# EAGLE design deathcap (EAGLE 8.2.1)
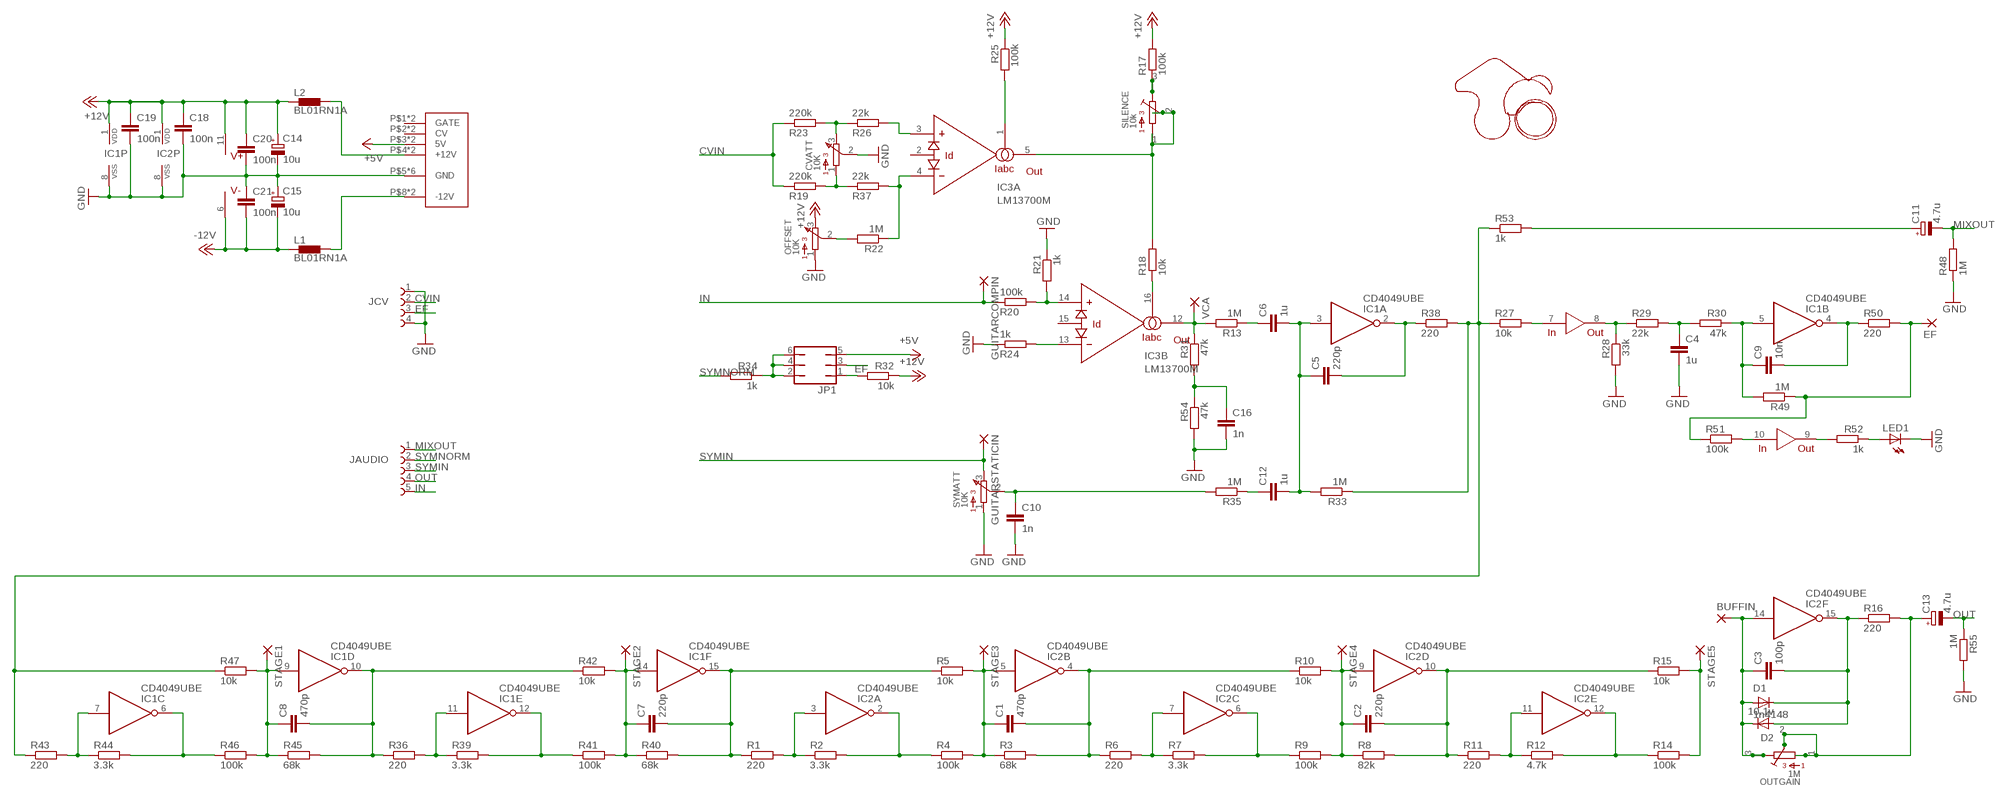
[diagram p0: schematic, sheet 1]

## Parts
BUFFIN  2,0/0,9-S  [2,0/0,9-S]
C1  470p  C-EUC1206  [C1206]
C2  220p  C-EUC1206  [C1206]
C3  100p  C-EUC1206  [C1206]
C4  1u  C-EUC1206  [C1206]
C5  220p  C-EUC1206  [C1206]
C6  1u  C-EUC1206  [C1206]
C7  220p  C-EUC1206  [C1206]
C8  470p  C-EUC1206  [C1206]
C9  10n  C-EUC1206  [C1206]
C10  1n  C-EUC1206  [C1206]
C11  4.7u  CPOL-EUD  [PANASONIC_D]
C12  1u  C-EUC1206  [C1206]
C13  4.7u  CPOL-EUD  [PANASONIC_D]
C14  10u  CPOL-EUD  [PANASONIC_D]
C15  10u  CPOL-EUD  [PANASONIC_D]
C16  1n  C-EUC1206  [C1206]
C18  100n  C-EUC1206  [C1206]
C19  100n  C-EUC1206  [C1206]
C20  100n  C-EUC1206  [C1206]
C21  100n  C-EUC1206  [C1206]
CVATT  10K  91  [91]
D1  1n4148  SOD123DIODE  [SOD-123_MINI-SMA]
D2  10.1v  SOD123DIODE  [SOD-123_MINI-SMA]
EF  2,0/0,9-S  [2,0/0,9-S]
GUITARCOMPIN  2,0/0,9-S  [2,0/0,9-S]
GUITARSTATICIN  2,0/0,9-S  [2,0/0,9-S]
IC1  CD4049UBE  [DIL16]
IC2  CD4049UBE  [DIL16]
IC3  LM13700M  [SO16]
JAUDIO  61300511121  [61300511121]
JCV  61300411121  [61300411121]
JP1  JP3Q  [JP3Q]
L1  BL01RN1A  [BL01RN1A]
L2  BL01RN1A  [BL01RN1A]
LED1  LED5MM  [LED5MM]
OFFSET  10K  91  [91]
OUTGAIN  1M  3386  [3386-MULTI]
R1  220  R-EU_R1206  [R1206]
R2  3.3k  R-EU_R1206  [R1206]
R3  68k  R-EU_R1206  [R1206]
R4  100k  R-EU_R1206  [R1206]
R5  10k  R-EU_R1206  [R1206]
R6  220  R-EU_R1206  [R1206]
R7  3.3k  R-EU_R1206  [R1206]
R8  82k  R-EU_R1206  [R1206]
R9  100k  R-EU_R1206  [R1206]
R10  10k  R-EU_R1206  [R1206]
R11  220  R-EU_R1206  [R1206]
R12  4.7k  R-EU_R1206  [R1206]
R13  1M  R-EU_R1206  [R1206]
R14  100k  R-EU_R1206  [R1206]
R15  10k  R-EU_R1206  [R1206]
R16  220  R-EU_R1206  [R1206]
R17  100k  R-EU_R1206  [R1206]
R18  10k  R-EU_R1206  [R1206]
R19  220k  R-EU_R1206  [R1206]
R20  100k  R-EU_R1206  [R1206]
R21  1k  R-EU_R1206  [R1206]
R22  1M  R-EU_R1206  [R1206]
R23  220k  R-EU_R1206  [R1206]
R24  1k  R-EU_R1206  [R1206]
R25  100k  R-EU_R1206  [R1206]
R26  22k  R-EU_R1206  [R1206]
R27  10k  R-EU_R1206  [R1206]
R28  33k  R-EU_R1206  [R1206]
R29  22k  R-EU_R1206  [R1206]
R30  47k  R-EU_R1206  [R1206]
R31  47k  R-EU_R1206  [R1206]
R32  10k  R-EU_R1206  [R1206]
R33  1M  R-EU_R1206  [R1206]
R34  1k  R-EU_R1206  [R1206]
R35  1M  R-EU_R1206  [R1206]
R36  220  R-EU_R1206  [R1206]
R37  22k  R-EU_R1206  [R1206]
R38  220  R-EU_R1206  [R1206]
R39  3.3k  R-EU_R1206  [R1206]
R40  68k  R-EU_R1206  [R1206]
R41  100k  R-EU_R1206  [R1206]
R42  10k  R-EU_R1206  [R1206]
R43  220  R-EU_R1206  [R1206]
R44  3.3k  R-EU_R1206  [R1206]
R45  68k  R-EU_R1206  [R1206]
R46  100k  R-EU_R1206  [R1206]
R47  10k  R-EU_R1206  [R1206]
R48  1M  R-EU_R1206  [R1206]
R49  1M  R-EU_R1206  [R1206]
R50  220  R-EU_R1206  [R1206]
R51  100k  R-EU_R1206  [R1206]
R52  1k  R-EU_R1206  [R1206]
R53  1k  R-EU_R1206  [R1206]
R54  47k  R-EU_R1206  [R1206]
R55  1M  R-EU_R1206  [R1206]
SILENCE  10k  3386  [3386-MULTI]
STAGE1  2,0/0,9-S  [2,0/0,9-S]
STAGE2  2,0/0,9-S  [2,0/0,9-S]
STAGE3  2,0/0,9-S  [2,0/0,9-S]
STAGE4  2,0/0,9-S  [2,0/0,9-S]
STAGE5  2,0/0,9-S  [2,0/0,9-S]
SYMATT  10K  91  [91]
U$1  EUROPWR  [EUROPWR]
U$2  LOGO  [LOGO]
VCA  2,0/0,9-S  [2,0/0,9-S]

## Nets
+5V: JP1.5 U$1.P$3(5V) U$1.P$14(5V)
+12V: C14.+ C18.1 C19.1 C20.1 IC1.1(P:VDD) IC2.1(P:VDD) IC3.11(V+) L2.1 OFFSET.3 R17.2 R25.1 R32.1
-12V: C15.- C21.2 IC3.6(V-) L1.1
CVIN: JCV.2 R19.1 R23.1
EF: JCV.3 JP1.3
GND: C4.2 C10.2 C14.- C15.+ C16.2 C18.2 C19.2 C20.2 C21.1 CVATT.2 IC1.8(P:VSS) IC2.8(P:VSS) JCV.1 JCV.4 LED1.K(C) OFFSET.1 R21.1 R24.1 R28.2 R48.1 R54.2 R55.2 SYMATT.1 U$1.P$5(GND) U$1.P$6(GND) U$1.P$7(GND) U$1.P$10(GND) U$1.P$11(GND) U$1.P$12(GND)
IN: GUITARCOMPIN.1(P) JAUDIO.5 R20.1
MIXOUT: C11.- JAUDIO.1 R48.2
N$1: IC3.16(B:IABC) R18.1
N$2: C1.1 IC2.5(B:I) R3.1 R4.2 R5.2 STAGE3.1(P)
N$3: C1.2 IC2.4(B:O) R3.2 R6.1 R10.1
N$4: IC2.3(A:I) R1.2 R2.1
N$5: IC2.2(A:O) R2.2 R4.1
N$6: C3.2 D1.C D2.A IC2.15(F:O) R16.1
N$7: C2.1 IC2.9(D:I) R8.1 R9.2 R10.2 STAGE4.1(P)
N$8: C2.2 IC2.10(D:O) R8.2 R11.1 R15.1
N$9: IC2.7(C:I) R6.2 R7.1
N$10: IC2.6(C:O) R7.2 R9.1
N$11: EF.1(P) R49.1 R50.2 R51.1
N$12: BUFFIN.1(P) C3.1 D1.A D2.C IC2.14(F:I) OUTGAIN.3 OUTGAIN.6
N$13: C9.2 IC1.4(B:O) R50.1
N$14: IC2.11(E:I) R11.2 R12.1
N$15: IC2.12(E:O) R12.2 R14.1
N$16: R1.1 R5.1
N$17: CVATT.1 R19.2 R37.1
N$18: IC3.13(B:-IN) R24.2
N$19: CVATT.3 R23.2 R26.1
N$20: IC3.14(B:+IN) R20.2 R21.2
N$21: IC3.5(A:OUT) R18.2 SILENCE.1 SILENCE.2 SILENCE.4 SILENCE.5
N$22: C6.1 R13.1
N$23: IC3.3(A:+IN) R26.2
N$24: C12.1 R35.1
N$25: OFFSET.2 R22.2
N$26: IC3.1(A:IABC) R25.2
N$27: IC3.7(IN) R27.2
N$28: IC3.8(OUT) R28.1 R29.1
N$29: C4.1 R29.2 R30.2
N$30: R17.1 SILENCE.3 SILENCE.6
N$31: C5.1 C6.2 C12.2 IC1.3(A:I) R33.2
N$32: C5.2 IC1.2(A:O) R38.1
N$33: IC3.10(IN) R51.2
N$34: IC3.9(OUT) R52.2
N$35: JP1.2 JP1.4 JP1.6 R34.1
N$36: IC3.12(B:OUT) R13.2 R31.1 VCA.1(P)
N$37: JP1.1 R32.2
N$38: IC3.4(A:-IN) R22.1 R37.2
N$39: C10.1 R35.2 SYMATT.2
N$40: R27.1 R33.1 R38.2 R43.1 R47.1 R53.1
N$41: C7.1 IC1.14(F:I) R40.1 R41.2 R42.2 STAGE2.1(P)
N$42: C7.2 IC1.15(F:O) R40.2
N$43: IC1.11(E:I) R36.2 R39.1
N$44: IC1.12(E:O) R39.2 R41.1
N$45: R36.1 R42.1
N$46: C8.1 IC1.9(D:I) R45.1 R46.2 R47.2 STAGE1.1(P)
N$47: C8.2 IC1.10(D:O) R45.2
N$48: IC1.7(C:I) R43.2 R44.1
N$49: IC1.6(C:O) R44.2 R46.1
N$50: C9.1 IC1.5(B:I) R30.1 R49.2
N$51: LED1.A R52.1
N$52: C11.+ R53.2
N$53: L2.2 U$1.P$4(+12V) U$1.P$13(+12V)
N$54: L1.2 U$1.P$8(-12V) U$1.P$9(-12V)
N$55: C16.1 R31.2 R54.1
N$56: C13.+ OUTGAIN.1 OUTGAIN.2 OUTGAIN.4 OUTGAIN.5 R16.2
N$57: R14.2 R15.2 STAGE5.1(P)
OUT: C13.- JAUDIO.4 R55.1
SYMIN: GUITARSTATICIN.1(P) JAUDIO.3 SYMATT.3
SYMNORM: JAUDIO.2 R34.2
Unconnected: IC3.2(A:ID) IC3.15(B:ID) U$1.P$1(GATE) U$1.P$2(CV) U$1.P$15(CV) U$1.P$16(GATE)

## Library data of the parts
BUFFIN EF GUITARCOMPIN GUITARSTATICIN STAGE1-STAGE5 VCA = synthdiy updated imperial:2,0/0,9-S: SQUARE THROUGH-HOLE PAD 2.0 mm, 0.9 mm/0.079",0.035"
C1-C10 C12 C16 C18-C21 = resistor:C-EU: CAPACITOR, European symbol
C11 C13-C15 = resistor:CPOL-EU: POLARIZED CAPACITOR, European symbol
CVATT OFFSET SYMATT = bourns:91: 91 Series Potentiometer
D1 D2 = stuaiff:SOD123DIODE: generalised sod 123 diode
IC1 IC2 = integrated circuits:CD4049UBE: Hex Inverting Buffer Used, for example, in the Red Llama, Three Legged Dog, and Hot Harmonics.
IC3 = synthdiy updated imperial:LM13700: National Dual OTA with buffers.
JAUDIO = Board-to-Board (rev17e):61300511121: WR-PHD 2.54mm Pin Header, 5 Pin =>Code : Con_BTB_PHD_2.54_1_THT_61300511121 <http://katalog.we-online.de/media/images/eican/Con_BTB_PHD_2.54_1_THT_6130xx11121_pf2.jpg> Details see: http://katalog.we-online.de/en/em/613_0xx_111_21 Created 2014-05-29, Karrer Zheng 2014 (C) Würth Elektronik
JCV = Board-to-Board (rev17e):61300411121: WR-PHD 2.54mm Pin Header, 4 Pin =>Code : Con_BTB_PHD_2.54_1_THT_61300411121 <http://katalog.we-online.de/media/images/eican/Con_BTB_PHD_2.54_1_THT_6130xx11121_pf2.jpg> Details see: http://katalog.we-online.de/en/em/613_0xx_111_21 Created 2014-05-29, Karrer Zheng 2014 (C) Würth Elektronik
JP1 = jumper:JP3Q: JUMPER
L1 L2 = inductors:BL0: Noise Suppression Products/EMI Suppression Filters, Lead EMIFIL(R) Inductor Type Source: http://www.murata.com .. BL01RN1_DS.pdf
LED1 = led:LED: LED OSRAM: - CHIPLED LG R971, LG N971, LY N971, LG Q971, LY Q971, LO R971, LY R971 LH N974, LH R974 LS Q976, LO Q976, LY Q976 LO Q996 - Hyper CHIPLED LW Q18S LB Q993, LB Q99A, LB R99A - SideLED LS A670, LO A670, LY A670, LG A670, LP A670 LB A673, LV A673, LT A673, LW A673 LH A674 LY A675 LS A676, LA A676, LO A676, LY A676, LW A676 LS A679, LY A679, LG A679 - Hyper Micro SIDELED® LS Y876, LA Y876, LO Y876, LY Y876 LT Y87S - SmartLED LW L88C, LW L88S LB L89C, LB L89S, LG L890 LS L89K, LO L89K, LY L89K LS L896, LA L896, LO L896, LY L896 - TOPLED LS T670, LO T670, LY T670, LG T670, LP T670 LSG T670, LSP T670, LSY T670, LOP T670, LYG T670 LG T671, LOG T671, LSG T671 LB T673, LV T673, LT T673, LW T673 LH T674 LS T676, LA T676, LO T676, LY T676, LB T676, LH T676, LSB T676, LW T676 LB T67C, LV T67C, LT T67C, LS T67K, LO T67K, LY T67K, LW E67C LS E67B, LA E67B, LO E67B, LY E67B, LB E67C, LV E67C, LT E67C LW T67C LS T679, LY T679, LG T679 LS T770, LO T770, LY T770, LG T770, LP T770 LB T773, LV T773, LT T773, LW T773 LH T774 LS E675, LA E675, LY E675, LS T675 LS T776, LA T776, LO T776, LY T776, LB T776 LHGB T686 LT T68C, LB T68C - Hyper Mini TOPLED® LB M676 - Mini TOPLED Santana® LG M470 LS M47K, LO M47K, LY M47K Source: http://www.osram.convergy.de LUXEON: - LUMILED® LXK2-PW12-R00, LXK2-PW12-S00, LXK2-PW14-U00, LXK2-PW14-V00 LXK2-PM12-R00, LXK2-PM12-S00, LXK2-PM14-U00 LXK2-PE12-Q00, LXK2-PE12-R00, LXK2-PE12-S00, LXK2-PE14-T00, LXK2-PE14-U00 LXK2-PB12-K00, LXK2-PB12-L00, LXK2-PB12-M00, LXK2-PB14-N00, LXK2-PB14-P00, LXK2-PB14-Q00 LXK2-PR12-L00, LXK2-PR12-M00, LXK2-PR14-Q00, LXK2-PR14-R00 LXK2-PD12-Q00, LXK2-PD12-R00, LXK2-PD12-S00 LXK2-PH12-R00, LXK2-PH12-S00 LXK2-PL12-P00, LXK2-PL12-Q00, LXK2-PL12-R00 Source: www.luxeon.com KINGBRIGHT: KA-3528ASYC Source: www.kingbright.com
OUTGAIN SILENCE = bourns:3386: 3386 Series 3/8" Square Trimmer (Multi-Package F,P,K & Y)
R1-R55 = resistor:R-EU_: RESISTOR, European symbol
U$1 = stuaiff:EUROPWR: standard 16 pin eurorack power connector
U$2 = stuaiff:LOGO

## Board
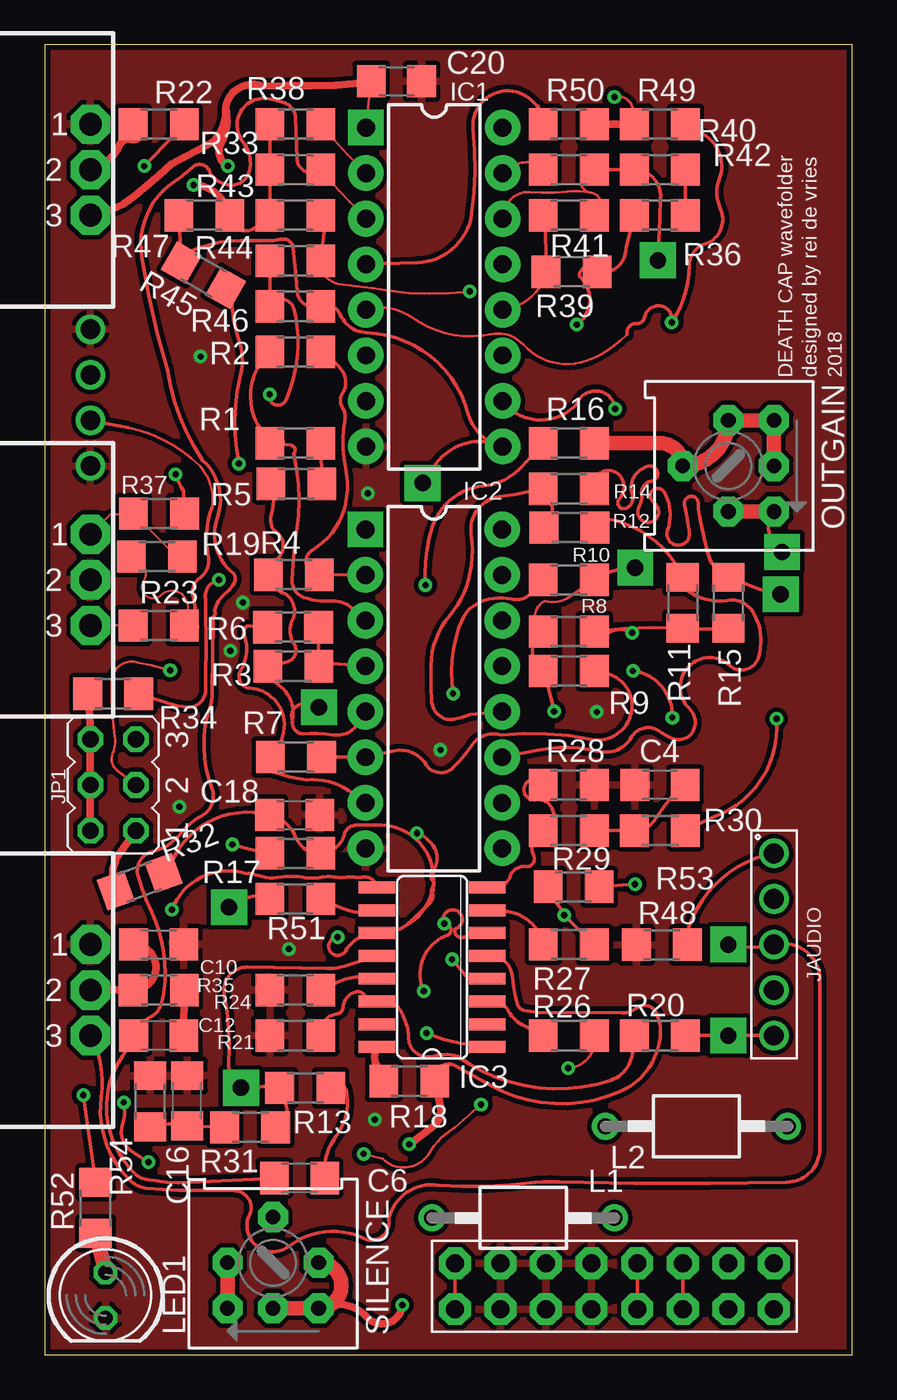
[diagram p1: board, top side]
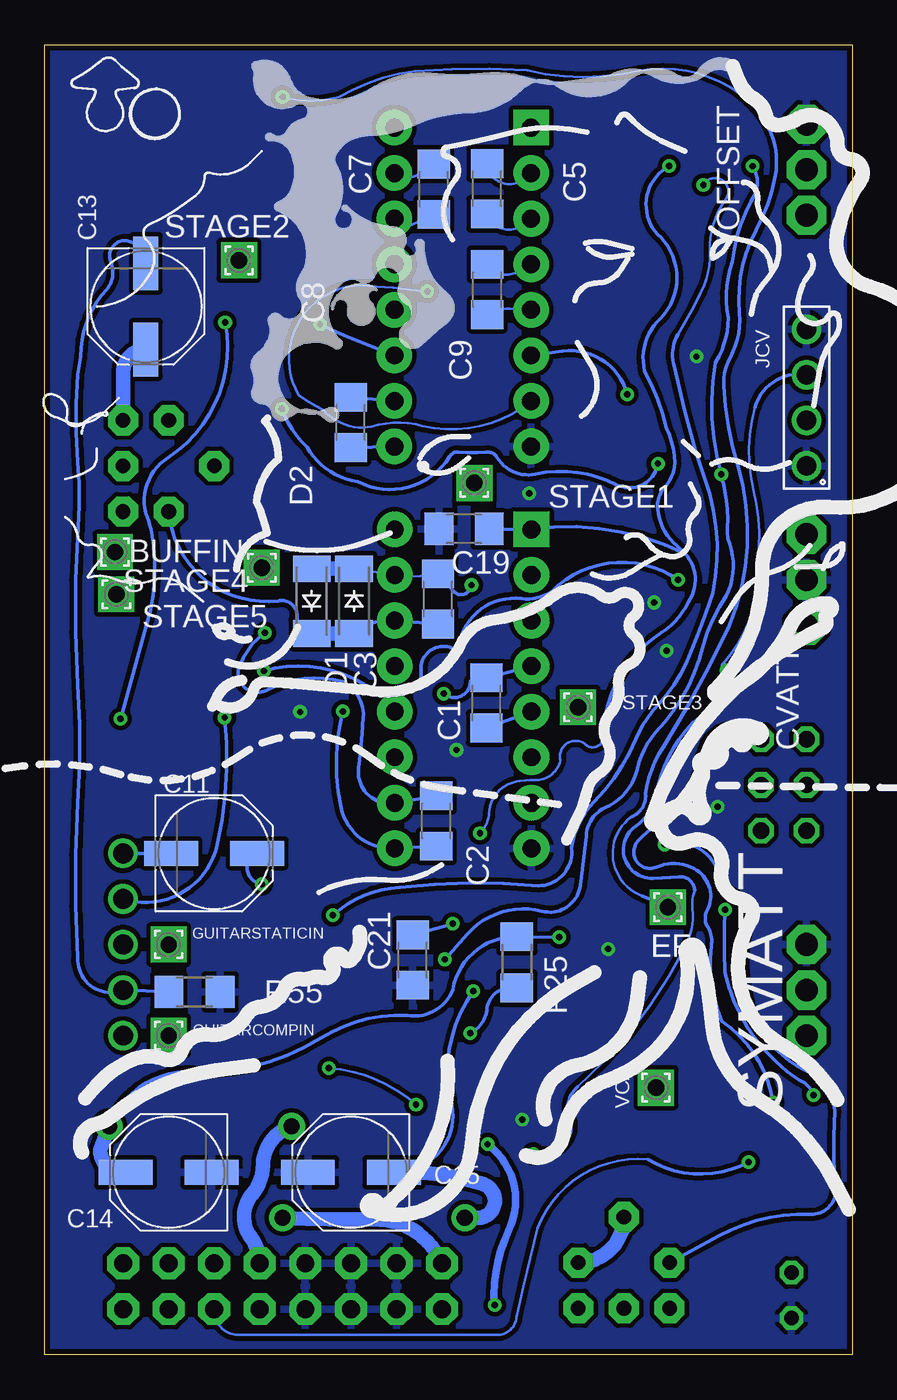
[diagram p2: board, bottom side, seen from below]

Size 45 x 73 mm. Coordinates in mm from the lower left corner, seen from the top.
Outline: 0,0 45,0 45,73 0,73 0,0
Copper layers (1*16): Top 0.035mm / dielectric 1.5mm / Bottom 0.035mm
Design rules "seeedincomplete": minimum track width 4mil, minimum drill 0.35mm, track to track 4mil, track to pad 4mil, pad to pad 4mil, via to via 12mil, smd to smd 4mil, copper to edge 0.3mm, drill to drill 6mil, minimum pad ring 10mil, minimum via ring 8mil, stop-mask expansion 4mil, vias tented up to drill 0mil, thermal gap 10mil

### Footprints (pad centres in the part's own frame; a part is rotated, then mirrored left to right if it is on the bottom)
2,0/0,9-S = drill 0.914 pad 2 square: 1 0,0
C1206 = smd 1.6 x 1.8: 1 -1.4,0; 2 1.4,0
PANASONIC_D = smd 3 x 1.4: + 2.4,0; - -2.4,0
91 = drill 1.27 pad 2.184 octagon: 1 0,2.54; 2 0,0; 3 0,-2.54
SOD-123_MINI-SMA = smd 1.5 x 2.1: A 1.8,0; C -1.8,0
DIL16 = drill 1 pad 1.981 square: 1 -8.89,-3.81 | drill 1 pad 1.981: 2 -6.35,-3.81; 3 -3.81,-3.81; 4 -1.27,-3.81; 5 1.27,-3.81; 6 3.81,-3.81; 7 6.35,-3.81; 8 8.89,-3.81; 9 8.89,3.81; 10 6.35,3.81; 11 3.81,3.81; 12 1.27,3.81; 13 -1.27,3.81; 14 -3.81,3.81; 15 -6.35,3.81; 16 -8.89,3.81
SO16 = smd 0.66 x 2.032: 1 -4.445,-3.073; 2 -3.175,-3.073; 3 -1.905,-3.073; 4 -0.635,-3.073; 5 0.635,-3.073; 6 1.905,-3.073; 7 3.175,-3.073; 8 4.445,-3.073; 9 4.445,3.073; 10 3.175,3.073; 11 1.905,3.073; 12 0.635,3.073; 13 -0.635,3.073; 14 -1.905,3.073; 15 -3.175,3.073; 16 -4.445,3.073
61300511121 = drill 1.1: 1 -5.08,0; 2 -2.54,0; 3 0,0; 4 2.54,0; 5 5.08,0
61300411121 = drill 1.1: 1 -3.81,0; 2 -1.27,0; 3 1.27,0; 4 3.81,0
JP3Q = drill 0.914 octagon: 1 -2.54,-1.27; 2 -2.54,1.27; 3 0,-1.27; 4 0,1.27; 5 2.54,-1.27; 6 2.54,1.27
BL01RN1A = drill 0.9 pad 1.5: 1 -5.08,0; 2 5.08,0
LED5MM = drill 0.813 octagon: A -1.27,0; K 1.27,0
3386-MULTI = drill 0.813 pad 1.676 octagon: 1 -2.54,0; 2 0,-2.54; 3 2.54,0; 4 -2.54,2.54; 5 0,2.54; 6 2.54,2.54
R1206 = smd 1.6 x 1.803: 1 -1.422,0; 2 1.422,0
EUROPWR = drill 1 pad 1.778 octagon: P$1 -1.27,8.89; P$2 -1.27,6.35; P$3 -1.27,3.81; P$4 -1.27,1.27; P$5 -1.27,-1.27; P$6 -1.27,-3.81; P$7 -1.27,-6.35; P$8 -1.27,-8.89; P$9 1.27,-8.89; P$10 1.27,-6.35; P$11 1.27,-3.81; P$12 1.27,-1.27; P$13 1.27,1.27; P$14 1.27,3.81; P$15 1.27,6.35; P$16 1.27,8.89

### Placement (x,y rotation side)
BUFFIN  41.09,44.73 0 bottom
C1  20.38,36.32 90 bottom
C2  23.18,29.74 90 bottom
C3  23.09,42.12 90 bottom
C4  34.29,31.75 180 top
C5  20.35,64.98 90 bottom
C6  14.2,9.84 180 top
C7  23.31,64.95 90 bottom
C8  27.95,51.96 90 bottom
C9  20.34,59.36 90 bottom
C10  6.35,22.86 0 top
C11  35.56,27.94 0 bottom
C12  6.35,17.78 180 top
C13  39.37,58.42 270 bottom
C14  38.1,10.16 180 bottom
C15  27.94,10.16 180 bottom
C16  7.93,14.16 90 top
C18  13.93,30.08 0 top
C19  21.63,46.02 180 bottom
C20  19.6,70.97 0 top
C21  24.5,21.99 90 bottom
CVATT  2.54,43.18 0 top
D1  27.77,42 270 bottom
D2  30.12,42 90 bottom
EF  10.27,24.94 0 bottom
GUITARCOMPIN  38.1,17.78 0 bottom
GUITARSTATICIN  38.1,22.86 0 bottom
IC1  21.71,59.5 270 top
IC2  21.68,37.11 270 top
IC3  21.59,21.59 90 top
JAUDIO  40.64,22.86 270 top
JCV  2.54,53.34 90 bottom
JP1  3.81,31.75 90 top
L1  26.67,7.62 0 top
L2  36.32,12.73 180 top
LED1  3.38,3.31 270 top
OFFSET  2.54,66.04 0 top
OUTGAIN  38.1,49.53 270 top
R1  13.97,50.8 180 top
R2  13.97,55.88 0 top
R3  13.85,38.36 0 top
R4  13.88,43.47 180 top
R5  14.02,48.53 180 top
R6  13.83,40.55 180 top
R7  14,33.31 0 top
R8  29.21,40.3 0 top
R9  29.21,38.1 180 top
R10  29.21,43.18 0 top
R11  35.56,41.91 90 top
R12  29.25,46.1 180 top
R13  14.51,14.87 180 top
R14  29.21,48.26 0 top
R15  38.1,41.91 90 top
R16  29.21,50.8 0 top
R17  13.97,27.94 0 top
R18  20.32,15.24 0 top
R19  6.25,44.48 0 top
R20  34.29,17.78 180 top
R21  13.97,17.78 0 top
R22  6.35,68.58 180 top
R23  6.35,40.64 180 top
R24  13.97,20.32 0 top
R25  18.69,21.87 270 bottom
R26  29.21,17.78 180 top
R27  29.21,22.86 180 top
R28  29.21,31.75 0 top
R29  29.21,29.21 0 top
R30  34.29,29.21 180 top
R31  11.44,12.67 180 top
R32  5.28,26.36 200 top
R33  13.97,66.04 0 top
R34  3.81,36.83 0 top
R35  6.35,20.32 180 top
R36  34.29,63.5 180 top
R37  6.37,46.88 0 top
R38  13.97,68.58 180 top
R39  29.36,60.35 180 top
R40  29.21,66.04 180 top
R41  29.21,63.5 0 top
R42  34.29,66.04 180 top
R43  13.97,63.5 0 top
R44  13.97,60.96 180 top
R45  8.84,60.15 330 top
R46  13.97,58.42 0 top
R47  8.89,63.5 180 top
R48  34.39,22.84 0 top
R49  34.29,68.58 0 top
R50  29.21,68.58 0 top
R51  13.97,25.4 0 top
R52  2.82,8.18 90 top
R53  29.48,26.08 0 top
R54  5.87,14.12 90 top
R55  36.66,20.22 0 bottom
SILENCE  12.72,5.13 180 top
STAGE1  21.06,48.59 0 bottom
STAGE2  34.17,60.99 0 bottom
STAGE3  15.28,36.08 0 bottom
STAGE4  32.91,43.86 0 bottom
STAGE5  41.02,42.38 0 bottom
SYMATT  2.54,20.32 0 top
U$1  31.75,3.81 270 top
U$2  40.34,69.27 0 bottom
VCA  10.93,14.87 0 bottom

### Tracks (layer width: path | path; a pad name or v marks a point on that pad's centre or on a via)
+5V  (via drill 0.35)
  Top 0.203: v5.77,10.73 4.81,11.36 arc-74 4.32,12.76 arc28 v4.4,14.06 | U$1.P$3 U$1.P$14
  Bottom 0.152: U$1.P$14 35.56,2.44 arc-90 34.22,1.1 19.79,1.1 arc-90 18.7,2.2 arc2 17.53,7.03 arc75 11.38,10.88 | JP1.5 arc-137 8.38,33.4
  Bottom 0.203: 11.38,10.88 arc-59 v5.77,10.73 | v4.4,14.06 arc-47 7.25,18.57 arc29 7.85,22.78 arc-43 8.05,23.83 arc60 8.08,24.74 arc-85 8.65,26.98 arc-57 10.89,27.17 arc156 11.93,28.63 arc16 10.83,29.54 arc-52 8.38,33.4
+12V  (via drill 0.35)
  Top 0.152: IC1.1 18.16,70.86
  Top 0.203: v16.32,23.26 arc239 16.77,22.5 arc-61 IC3.11 arc30 20.11,23.89 | 20.11,23.89 arc150 18.75,29.51 arc3 17.33,29.51 arc74 16.7,29 arc-73 R17.2 arc-71 13.96,28.88 arc58 C18.1 arc83 7.04,27.38 arc-27 6.82,26.73 arc-97 6.05,26.68 R32.1 | v20.74,29.07 arc-41 21.72,28.25 arc-69 21.59,26.92 arc88 21.63,26.42 arc-95 21.63,26.07 arc95 21.63,25.98 | 21.63,25.85 arc95 21.63,25.98 | 20.11,23.89 21.47,25.19 arc76 21.56,25.82 arc-102 21.63,25.98
  Top 0.406: C20.1 arc37 18.16,70.86 arc11 16.23,70.74 arc0 12.1,70.7 arc104 10.07,69.46 | v10.2,66.25 arc-90 9.82,67.51 arc42 10.07,69.46 | 10.07,69.46 arc-55 9.25,67.51 arc1 7.04,66.34 arc-1 4.99,64.58 arc-33 OFFSET.3
  Bottom 0.152: v20.74,29.07 arc-42 20.24,30.19 arc81 18.53,31.97 arc4 17.59,32.03 arc-77 16.26,33.12 arc93 15.56,34.2 arc36 14.92,34.07 arc-118 13.91,34.21
  Bottom 0.203: v16.32,23.26 R25.1 arc-82 22.26,20.36 arc79 24.78,18.91 arc-35 29.61,17.64 arc35 36.72,15.78 arc-72 L2.1 | C19.1 IC2.1 arc34 9.32,44.66 | 9.32,44.66 arc77 9.11,41.96 arc32 10.64,40.24 arc-56 13.91,34.21 | 9.32,44.66 9.77,45.08 arc45 10.84,47.13 arc44 10.51,48.26 arc-37 9.87,49.7 arc-23 10.36,51.65 arc-15 11.57,54.82 arc60 10.7,57.74 arc-89 10.67,62.27 arc110 v10.2,66.25
  Bottom 0.813: L2.1 41.91,11.4 arc-98 C14.+
-12V  (via drill 0.35)
  Top 0.203: IC3.6 arc91 23.55,23.39 arc-155 22.86,23.73 arc283 v22.26,24.02 arc-155 22.48,23.39 arc96 v21.12,20.26
  Bottom 0.203: C21.2 v22.26,24.02 | v21.12,20.26 arc-47 22.39,14.17 arc101 24.94,10.29 arc-316 24.85,10.23 arc-28 25.42,10.73 arc-210 C15.-
  Bottom 0.813: L1.1 20.88,7.62 arc-163 20.58,9.51 arc-21 C15.-
CVIN
  Top 0.102: R23.1 7.96,41.47 arc147 6.46,42.32 arc-165 5.51,43.08 arc109 R19.1
  Top 0.152: 4.64,51.66 arc-34 8.65,49.51 arc-51 9.32,47.23 | R19.1 arc-324 5.05,44.46 arc-36 R19.1
  Top 0.203: R23.1 arc199 8.51,40.6 arc3 8.29,42.17 arc-70 8.59,43.26 arc72 9.1,44.55 arc-32 9.32,47.23 | 4.64,51.66 JCV.2
EF  (via drill 0.35 pad 0.55)
  Top 0.127: JP1.3 4.05,32.53 arc-75 3.79,33.52 arc31 3.9,34.46 arc-11 3.71,37.53 arc-110 5.27,38.55 arc-11 7.12,38.06 arc19 v6.99,38.14
  Bottom 0.127: v6.99,38.14 arc158 7.19,38.53 arc-47 5.27,44.19 arc-21 5.5,48.21 arc30 5.42,52.79
  Bottom 0.203: 5.42,52.79 arc84 JCV.3
GND  (via drill 0.35, 0.35 pad 0.55)
  other vias: 8.68,55.63 18.4,13.1 18,48 22.05,33.7 7.5,30.54 11.04,41.92 13.59,22.61 30.77,35.82 10.35,39.23
  pour Top (isolate 0.254): 0,73 45,73 45,0 0,0
  pour Bottom (isolate 0.254): 0,0 0,73 45,73 45,0
IN
  Top 0.203: JAUDIO.5 GUITARCOMPIN.1 R20.1
MIXOUT
  Top 0.203: R48.2 35.91,23.86 arc-60 JAUDIO.1
  Bottom 0.203: JAUDIO.1 C11.-
N$1
  Top 0.406: R18.1 18.49,16.14 arc-52 IC3.16
N$2
  Top 0.203: 12.68,38.42 R3.1 | 12.68,38.42 13.49,38.61 arc112 13.88,39.62 arc-65 13.88,41.09 arc68 13.42,42.4 arc-75 12.83,43.02 arc156 R4.2 arc-222 12.62,44.17 arc136 12.77,45.94 arc-48 12.63,46.88 arc36 R5.2 | IC2.5 17.46,35.18 arc-68 16.07,34.55 arc15 14.36,34.6 arc-96 13.81,35.36 | 13.81,35.36 arc67 13.04,37.31 arc-74 12.68,38.42 | STAGE3.1 14.58,36.25 arc74 13.84,35.93 arc52 13.81,35.36
  Bottom 0.203: C1.1 IC2.5
N$3  (via drill 0.35)
  Top 0.203: 15.27,38.57 R6.1 | 15.27,38.57 R3.2 | IC2.4 15.27,38.57 | R10.1 27.12,42.45 arc-59 26.05,42.1 arc23 24.75,42.1 arc46 23.33,41.12 arc34 v22.76,36.84
  Bottom 0.203: IC2.4 C1.2 arc-146 20.52,37.84 arc155 20.59,37.68 arc-39 21.28,37.56 arc134 v22.76,36.84
N$4
  Top 0.203: 13.27,50.92 arc-198 R1.2 | IC2.3 17.15,41.58 arc48 15.91,42.01 arc-25 14.44,42.21 arc-72 13.78,43.19 arc-6 14.04,45.9 arc22 13.88,50.22 arc129 13.71,50.68 R1.2 | R1.2 12.03,51.57 arc-82 R2.1
N$5
  Top 0.203: IC2.2 R4.1 arc-149 14.93,44.86 arc47 16.76,47.41 arc24 16.76,49.44 arc-23 16.73,52.12 arc44 16.6,52.77 arc-66 16.6,53.59 arc69 16.56,54.84 arc24 R2.2
N$6  (via drill 0.35)
  Top 0.203: R16.1 26.58,49.49 arc-42 24.44,48.41 arc67 21.59,46.11 arc22 v21.22,42.89
  Bottom 0.152: D1.C IC2.15 arc-20 C3.2
  Bottom 0.203: v21.22,42.89 arc145 22.29,42.64 arc-23 C3.2
  Bottom 0.813: D1.C D2.A
N$7  (via drill 0.35)
  Top 0.152: 29.45,42.38 arc-56 27.86,41.99 arc122 R8.1
  Top 0.203: 29.45,42.38 R10.2 arc-35 STAGE4.1 | R8.1 arc116 R9.2 arc-4 v28.39,35.85
  Bottom 0.203: C2.1 IC2.9 arc81 28.5,30.51 arc26 v28.39,35.85
N$8  (via drill 0.35)
  Top 0.203: R15.1 arc-7 R11.1 arc11 R8.2 arc239 31,39.81 arc-90 v32.74,40.23
  Bottom 0.203: C2.2 IC2.10 arc107 27.51,32.71 arc-4 27.25,35.52 arc-66 28.41,37.52 arc-41 32.54,37.08 arc158 34.03,38.6 arc32 v32.74,40.23
N$9
  Top 0.203: IC2.7 16.92,31.44 arc40 14.58,32.03 arc-12 12.74,32.49 arc-112 R7.1 arc43 13.37,35.14 arc85 11.38,37.15 arc-117 10.95,38.18 arc51 11.09,40.18 arc-125 11.47,40.61 arc19 R6.2
N$10
  Top 0.203: R7.2 IC2.6 arc-2 19.44,33.66 arc-70 21.25,32.89 arc103 22.76,32.72 arc11 23.83,34.01 arc-73 25.45,34.53 arc-17 30.46,34.3 arc182 31.16,38.01 R9.1
N$11  (via drill 0.35 pad 0.55)
  Top 0.127: v31.75,70.09 arc-169 32.34,68.58
  Top 0.203: EF.1 11.21,25.42 arc-56 R51.1
  Top 0.406: R49.1 32.34,68.58 R50.2
  Bottom 0.127: 5.73,69.85 arc-52 11.86,71.55 arc26 18.14,71.58 arc-8 24.37,71.54 arc-22 28.62,70.09 arc31 v31.75,70.09
  Bottom 0.152: 12.31,29.97 arc-123 11.72,25.58
  Bottom 0.203: 12.31,29.97 arc-73 11.51,31.25 arc26 10.53,33.87 arc-8 6.85,40.64 arc-39 6.38,49.55 arc13 7.16,53.98 arc32 6.8,55.57 arc-34 6.29,58.03 arc34 5.34,62.69 arc-17 4.3,65.61 arc-59 5.73,69.85 | 11.72,25.58 arc6 EF.1
N$12
  Top 0.203: OUTGAIN.6 arc80 40.59,45.38 BUFFIN.1
  Top 0.813: OUTGAIN.6 OUTGAIN.3
  Bottom 0.203: C3.1 IC2.14 arc-45 D1.A | D2.C arc87 30.94,41.29 arc-94 31.98,42.01 arc92 OUTGAIN.3
  Bottom 0.813: D1.A D2.C
N$13
  Top 0.152: R50.1 27.64,69.14 27.52,69.61
  Top 0.203: IC1.4 20.77,60.86 arc80 23.8,63.59 arc14 23.87,68.29 arc-167 27.64,69.14
  Bottom 0.152: IC1.4 18.7,60.34 arc86 C9.2
N$14
  Top 0.203: R12.1 31.34,46.58 arc-56 R11.2 arc78 35.66,42.72 arc51 38.08,42.04 arc-65 39.4,41.49 arc-48 39.85,39.12 arc-129 38.12,38.43 arc43 37.06,38.85 arc137 35.93,36.01 arc-67 36.19,34.87 arc-92 34.98,34.34 arc-12 34.22,34.76 arc95 32.71,34.42 arc-74 30.85,33.63 arc25 27.54,33.71 IC2.11
N$15
  Top 0.203: R12.2 arc95 R14.1 arc-5 25.36,47.82 arc91 23.76,45.7 arc-24 23.61,43.17 arc-25 22.55,41.16 arc40 21.53,38.4 arc3 21.56,36.5 arc108 22.97,35.44 arc0 23.72,35.68 IC2.12
N$16
  Top 0.203: R1.1 arc2 R5.1
N$17
  Top 0.102: CVATT.1 3.66,46.84 4.88,46.84 R37.1 4.98,46.84 7.32,44.5 7.72,44.5 R19.2
N$18
  Top 0.203: R24.2 16.22,20.72 arc-40 IC3.13
N$19  (via drill 0.35 pad 0.55)
  Top 0.102: 4.43,40.64 CVATT.3
  Top 0.127: 4.43,40.64 R23.2
  Top 0.152: v17.77,11.19 18.84,10.92 arc110 21.52,11.39 arc-24 22.86,12.68 arc0 v24.31,13.94 | v29.17,15.96 arc95 R26.1
  Bottom 0.127: CVATT.3 4.47,38.97 arc1 8.87,35.22
  Bottom 0.152: 8.78,25.87 arc-28 8.9,24.86 arc33 9.25,22.84 arc22 15.31,14.92 | v24.31,13.94 arc-37 v29.17,15.96
  Bottom 0.203: 8.87,35.22 arc-36 10.93,31.1 arc41 12.07,29.45 arc-147 11.09,26.54 arc-1 9.63,26.64 arc91 8.78,25.87 | 15.31,14.92 arc-68 15.75,13.23 arc122 17.51,11.26 arc-18 v17.77,11.19
N$20
  Top 0.203: R20.2 32.75,16.77 arc-65 31.55,15.3 arc-55 23.01,16.64 arc30 21.66,16.63 arc-106 20.27,17.71 arc15 20.21,18.24 arc21 19.72,19.32 arc77 IC3.14 arc-89 17.85,19.96 arc81 17.34,20.22 arc73 16.62,19.35 arc-80 16.29,18.99 arc93 R21.2
N$21  (via drill 0.35)
  Top 0.203: R18.2 arc-132 22.9,16.09 arc1 24.84,15 arc52 32.04,14.64 arc60 34.3,17.64 arc30 34.11,19.01 arc104 32.97,19.31 arc-38 32.15,19.03 27.46,19.09 arc-15 26.69,19.2 arc-59 26.34,19.55 arc-11 26.07,21.08 arc92 IC3.5
  Top 0.406: R18.2 22.05,13.84 arc-65 21.62,12.7 v20.32,11.72 | v19.93,2.76 arc-133 17.97,2.08 arc73 SILENCE.4
  Top 0.813: SILENCE.5 SILENCE.4 arc180 SILENCE.1
  Bottom 0.406: v20.32,11.72 arc79 19.14,6.9 arc-30 v19.93,2.76
  Bottom 0.813: SILENCE.2 arc90 SILENCE.1
N$22
  Top 0.203: R13.1 15.44,15.18 arc-123 16.85,14.44 arc-44 16.24,12.18 arc43 C6.1
N$23
  Top 0.203: R26.2 26.61,18.38 arc-36 25.85,19.14 arc77 IC3.3
N$24
  Top 0.406: R35.1 C12.1
N$25
  Top 0.102: 4.88,68.38 4.88,68.58 R22.2
  Top 0.406: R22.2 arc-196 4.81,67.73 arc81 4.18,67.44 arc-49 OFFSET.2
N$26  (via drill 0.35)
  Top 0.203: IC3.1 23.21,17.36 arc-16 v21.28,17.93
  Bottom 0.203: v21.28,17.93 arc-60 20.36,19.22 arc98 R25.2
N$27
  Top 0.203: IC3.7 25.61,24.71 arc-75 R27.2
N$28
  Top 0.203: 27.89,31.55 R28.1 arc251 27.36,30.93 arc-168 R29.1 arc97 27.25,27.84 arc-124 26.8,27.21 arc79 25.92,26.64 arc-93 IC3.8
N$29
  Top 0.203: R29.2 R30.2 arc59 34.06,29.89 arc-21 C4.1
N$30  (via drill 0.35)
  Top 0.203: 12.49,27.84 R17.1 arc-7 v10.45,28.44
  Top 0.813: SILENCE.3 SILENCE.6
  Bottom 0.203: SILENCE.3 7.42,6.63 arc31 2.31,7.83 arc-102 0.92,9.4 arc10 0.95,13.55 arc-64 2.62,15.84 arc49 5.78,19.69 arc29 5.81,23.92 arc-75 6.54,25.63 arc45 7.42,26.76 arc-91 v10.45,28.44
N$31
  Top 0.152: IC1.3 16.96,64.28 arc-4 R33.2
  Top 0.203: C6.2 8.06,9.6 arc-14 5.62,9.78 arc-33 5.03,10.08 arc-52 3.47,14.36 arc-29 4.33,16.65 arc13 C12.2 arc-40 5.94,18.86 arc47 6.48,19.53 arc16 6.71,21.27 arc25 5.94,24.67 arc-10 5.17,26.76 arc-90 6.12,28.08 arc37 7.61,29.08 arc-25 8.74,30.03 arc79 9.34,31.45 arc-34 9.06,35.69 arc22 9.34,36.97 9.38,40.88 arc-90 9.39,41.14 arc90 9.46,41.45 arc-30 9.96,42.34 arc26 10.56,43 arc53 10.54,43.52 arc-69 9.57,46.52 arc70 8.81,49.84 arc-26 6.84,54.85 arc-7 5.4,61.2 arc-65 7.2,65.37 arc7 8.25,66.19 arc-108 9.17,65.98 arc73 10.53,65.19 arc73 11.42,66.01 arc50 11.04,67.6 arc-138 12.45,70 arc-10 13.34,69.77 arc-68 13.98,68.9 arc-1 14.06,66.65 arc128 R33.2
  Bottom 0.152: IC1.3 18.33,62.97 arc110 C5.1
N$32
  Top 0.152: IC1.2 16.89,66.89 arc-6 R38.1
  Bottom 0.152: IC1.2 18.31,65.52 arc124 C5.2
N$33
  Top 0.203: R51.2 16.52,24.9 arc41 IC3.10
N$34  (via drill 0.35)
  Top 0.203: R52.2 v2.14,14.47 | v7.09,24.8 arc-86 11.18,26.83 arc-22 11.89,26.7 arc27 13.2,26.61 arc-20 14.31,26.61 arc20 15.46,26.61 arc-20 16.2,26.61 arc20 16.85,26.61 arc-20 17.26,26.61 arc20 17.72,26.61 arc-92 IC3.9
  Bottom 0.203: v2.14,14.47 arc-49 2.96,15.31 arc44 7.09,21.3 arc4 v7.09,24.8
N$35
  Top 0.406: JP1.2 JP1.4 JP1.6 arc7 R34.1
N$36
  Top 0.203: IC3.12 16.69,21.65 arc-19 15.73,21.52 arc0 11.29,21.6 arc102 10.01,20.07 arc-15 10.25,16.17 arc63 VCA.1 arc54 11.7,14.82 arc-42 R13.2 | R13.2 arc-235 13.33,15.01 | 13.48,13.12 R31.1 | 13.48,13.12 13.57,13.18 | R13.2 13.19,14.4 arc-49 13.48,13.12
N$37
  Top 0.406: JP1.1 4.15,27.91 arc59 R32.2
N$38  (via drill 0.35)
  Top 0.203: R37.2 7.74,48.13 arc-14 v7.29,49.07 | R22.1 v5.54,66.24 | v22.7,22.03 arc-2 23.46,21.15 arc82 IC3.4
  Bottom 0.203: v5.54,66.24 arc66 5.61,64.32 arc-24 6.67,60.91 arc-32 6.9,57.79 arc31 7.61,55.3 arc-27 v7.29,49.07 arc15 6.94,46.51 arc-7 6.92,45.47 arc48 7,42.31 arc-18 8.3,39.55 arc31 10.95,34.68 arc-27 11.98,32.64 arc53 13.76,30.49 arc-65 14.81,28.91 arc-1 15.15,26.16 arc98 17.27,24.71 arc-63 21.44,23.45 arc0 v22.7,22.03
N$39
  Top 0.406: SYMATT.2 R35.2 arc179 C10.1
N$40  (via drill 0.35)
  Top 0.203: R38.2 R33.1 R43.1 arc-39 11.43,62.67 arc-107 R47.1 | R27.1 29.77,23.67 | 29.77,23.67 arc-22 R53.1 | 29.77,23.67 v28.95,24.49
  Top 0.406: v8.29,65.2 arc-74 R47.1
  Bottom 0.152: 9.71,56.86 arc-4 8.43,59.21 arc-29 7.93,61.48 arc38 7.04,64.39 arc-187 v8.29,65.2
  Bottom 0.203: v28.95,24.49 arc39 25.22,26.04 arc12 17.49,26.13 arc-96 15.64,28.25 arc36 14.36,30.84 arc-21 12.05,34.31 arc20 10.76,36.27 arc-24 9.02,39.12 arc-5 7.77,42.45 arc-28 7.94,47.96 arc7 9.91,55.08 arc48 9.71,56.86
N$41
  Top 0.152: IC1.14 25.66,63.83 arc-79 27.04,64.8 arc11 29.1,64.82 arc-17 30.48,64.75 | 30.48,64.75 arc-144 R41.2 | R40.1 arc43 30.09,65.83 arc134 30.48,64.75
  Top 0.203: R40.1 R42.2 arc-95 34.32,64.46 arc6 34.29,63.32 STAGE2.1
  Bottom 0.152: C7.1 24.64,62.92 arc100 IC1.14
N$42
  Top 0.152: IC1.15 26.12,66.24 arc-79 R40.2
  Bottom 0.152: C7.2 24.17,65.78 arc74 IC1.15
N$43  (via drill 0.35)
  Top 0.203: R36.2 32.38,61.66 arc-106 R39.1 arc153 29.79,60.1 arc-104 v29.65,57.41
  Bottom 0.203: v29.65,57.41 arc-5 IC1.11
N$44
  Top 0.152: R39.2 arc-70 IC1.12
  Top 0.203: R41.1 arc-9 R39.2
N$45
  Top 0.203: R42.1 35.71,65.18 R36.1
N$46
  Top 0.203: 7.59,61.23 R47.2 | 7.59,61.23 R45.1 | 7.59,61.23 arc-29 10.92,62.09 arc0 12.6,62.09 arc16 13.11,62.16 arc-100 13.85,61.67 arc-2 14.07,59.28 arc106 R46.2 arc-85 16.46,57.98 arc63 17.9,56.96 arc-73 23.6,52.45 arc64 IC1.9 arc80 21.79,49.62 STAGE1.1
  Bottom 0.203: IC1.9 C8.1
N$47  (via drill 0.35)
  Top 0.203: R45.2 10.39,59.11 arc15 10.86,56.4 arc-33 10.89,54.51 arc26 v10.82,49.66 | v31.79,52.72 arc153 29.65,53 arc-102 IC1.10
  Bottom 0.203: C8.2 IC1.10 | v10.82,49.66 arc107 13.1,48.48 arc-39 17.65,49.08 arc71 19.78,50 arc-65 20.39,50.31 arc12 21.98,50.31 arc-72 22.43,50.04 arc85 27.56,48.67 arc54 30.37,50.59 arc27 v31.79,52.72
N$48  (via drill 0.35)
  Top 0.152: R44.1 arc88 16.41,59.68 arc-1 19.18,59.3 arc15 v23.69,59.26
  Top 0.203: R44.1 15.48,61.82 15.71,63.77 arc299 R43.2
  Bottom 0.152: v23.69,59.26 arc-4 26.53,59.52 arc-131 30.85,53.47 arc-11 29.47,52.64 arc-60 26.78,51.73 arc32 23.95,51.76 arc-53 IC1.7
N$49  (via drill 0.35)
  Top 0.203: R44.2 R46.1 arc-139 13.89,58.26 arc-19 14.08,55.74 arc-18 13.45,53.21 arc-172 v12.53,53.53
  Bottom 0.203: IC1.6 16.13,55.93 arc82 v12.53,53.53
N$50  (via drill 0.35)
  Top 0.152: 32.46,56.84 arc-21 30.43,55.48 arc-71 26.67,56.29 arc59 24.91,56.87 arc-47 20.44,57.81 arc52 IC1.5
  Top 0.203: R30.1 37.22,29.95 arc76 v40.78,35.44 | 32.46,56.84 arc-107 32.99,57.47 arc84 33.44,57.82 arc-181 v34.95,57.54 arc33 35.94,60.74 arc-72 36.79,61.9 arc97 37.66,63.87 arc-46 37.6,65.53 arc81 36.71,68.01 R49.2
  Bottom 0.152: IC1.5 19.07,58.29 arc-34 C9.1
  Bottom 0.203: v40.78,35.44 39.12,41.41 arc-24 39.09,45.98 arc-11 39.31,46.71 arc15 39.43,47.18 arc65 38.14,49.99 arc-68 v34.95,57.54
N$51
  Top 0.813: LED1.A R52.1
N$52  (via drill 0.35)
  Top 0.203: R53.2 v32.9,26.23
  Bottom 0.203: v32.9,26.23 arc154 C11.+
N$53
  Top 0.203: U$1.P$13 U$1.P$4
  Bottom 0.813: U$1.P$4 arc-37 33.5,6.52 arc76 33.46,8.9 arc-41 32.82,10.83 arc64 L2.2
N$54
  Top 0.203: U$1.P$9 U$1.P$8
  Bottom 0.813: L1.2 30.39,7.58 arc-2 26.64,7.54 arc67 U$1.P$8
N$55
  Top 0.203: R31.2 C16.1 arc28 R54.1
N$56
  Top 0.813: R16.2 34.29,50.8 arc-90 OUTGAIN.2 arc90 OUTGAIN.1 OUTGAIN.4 OUTGAIN.5
  Bottom 0.813: OUTGAIN.4 40.64,54.75 arc90 C13.+
N$57
  Top 0.203: R14.2 arc-155 32.06,48.98 arc-82 32.02,47.69 arc151 32.37,47.16 arc91 32.74,47.92 arc-97 33.65,49.51 arc-183 33.8,48.68 arc89 33.27,47.96 arc-33 33.1,47.22 arc230 34.16,47.22 arc5 33.8,47.66 arc-181 34.52,48.07 arc-49 34.71,45.95 arc208 35.93,45.84 arc2 35.66,47.39 arc-190 36.42,47.47 arc11 36.53,46.48 arc2 36.99,44.59 arc54 R15.2 39.53,42.77 arc14 STAGE5.1
OUT
  Bottom 0.203: C13.- 39.71,61.44 arc-191 41.32,60.89 arc62 41.56,59.36 arc-39 42.97,56.13 arc6 43.16,54.62 arc-10 43.16,49.75 arc10 43.13,46.12 arc-8 43.16,37.32 arc8 43.16,30.74 arc-8 43.16,22.13 arc-116 JAUDIO.4 | R55.1 JAUDIO.4 | 40.79,20.07 JAUDIO.4
SYMIN
  Top 0.203: SYMATT.3 arc-36 3.15,14.39 arc55 4.81,9.66 arc38 5.65,9.28 arc6 8.38,9.16 arc-3 10.61,9.13 arc-113 11.41,7.8 arc152 13.57,6.02 arc-15 14.59,6.59 arc-50 17.96,6.4 arc109 19.17,7.53 arc-87 21.95,9.45 arc13 27.32,9.61 arc-7 28.64,9.62 arc2 41.35,9.62 arc90 43.2,11.47 43.2,21.12 arc96 JAUDIO.3 arc-28 GUITARSTATICIN.1
SYMNORM  (via drill 0.35)
  Top 0.203: R34.2 7.2,36.2 arc7 7.93,36.09 arc96 8.96,37.08 arc0 8.98,38.97 8.96,42.1 arc-90 v9.71,43.19 | v32.78,38.11 arc-85 v34.98,35.51
  Bottom 0.203: v9.71,43.19 arc-80 16.73,42.54 arc39 18.44,42.13 arc-88 21.9,39.55 arc108 22.21,39.34 arc-125 24.03,38.03 arc94 24.69,37.18 arc0 26.08,37.05 arc42 27.21,37.37 arc-47 v32.78,38.11 | v34.98,35.51 arc19 35.39,28.41 arc50 37.57,25.63 arc45 JAUDIO.2

### Text on the board
tNames: DEATH CAP wavefolder / designed by rei de vries / 2018